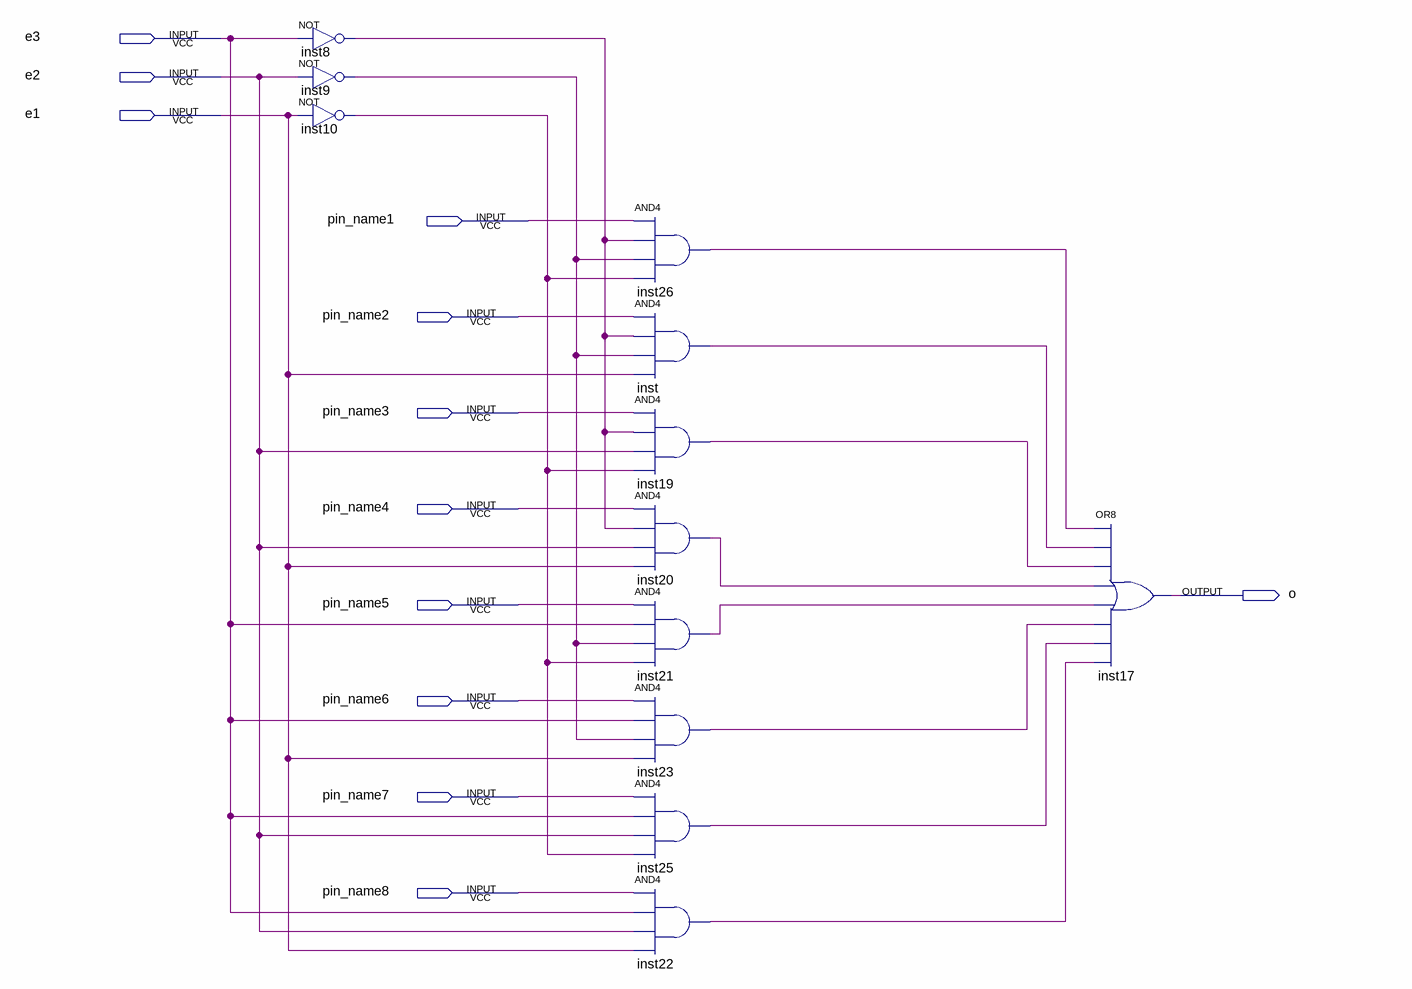
[diagram p0: schematic sheet]
// Quartus schematic mux8to1.bdf as structural Verilog: 12 symbols, 12 pins
module mux8to1 (
  input  e3,
  input  e2,
  input  e1,
  input  pin_name1,
  input  pin_name2,
  input  pin_name3,
  input  pin_name4,
  input  pin_name5,
  input  pin_name6,
  input  pin_name7,
  input  pin_name8,
  output o
);

  wire inst8_out, inst9_out, inst10_out, inst19_out, inst20_out, inst21_out, inst22_out, inst23_out,
       inst25_out, inst26_out, inst_out;

  not inst8 (inst8_out, e3);
  not inst9 (inst9_out, e2);
  not inst10 (inst10_out, e1);
  and inst26 (inst26_out, pin_name1, inst8_out, inst9_out, inst10_out);
  and inst (inst_out, pin_name2, inst8_out, inst9_out, e1);
  and inst19 (inst19_out, pin_name3, inst8_out, e2, inst10_out);
  and inst20 (inst20_out, pin_name4, inst8_out, e2, e1);
  and inst21 (inst21_out, pin_name5, e3, inst9_out, inst10_out);
  and inst23 (inst23_out, pin_name6, e3, inst9_out, e1);
  and inst25 (inst25_out, pin_name7, e3, e2, inst10_out);
  and inst22 (inst22_out, pin_name8, e3, e2, e1);
  or inst17 (o, inst26_out, inst_out, inst19_out, inst20_out, inst21_out, inst23_out, inst25_out, inst22_out);
endmodule
